# Altium schematic sheet 04 PCIe.SchDoc
size A3; SheetNumber: 5; SheetTotal: 16
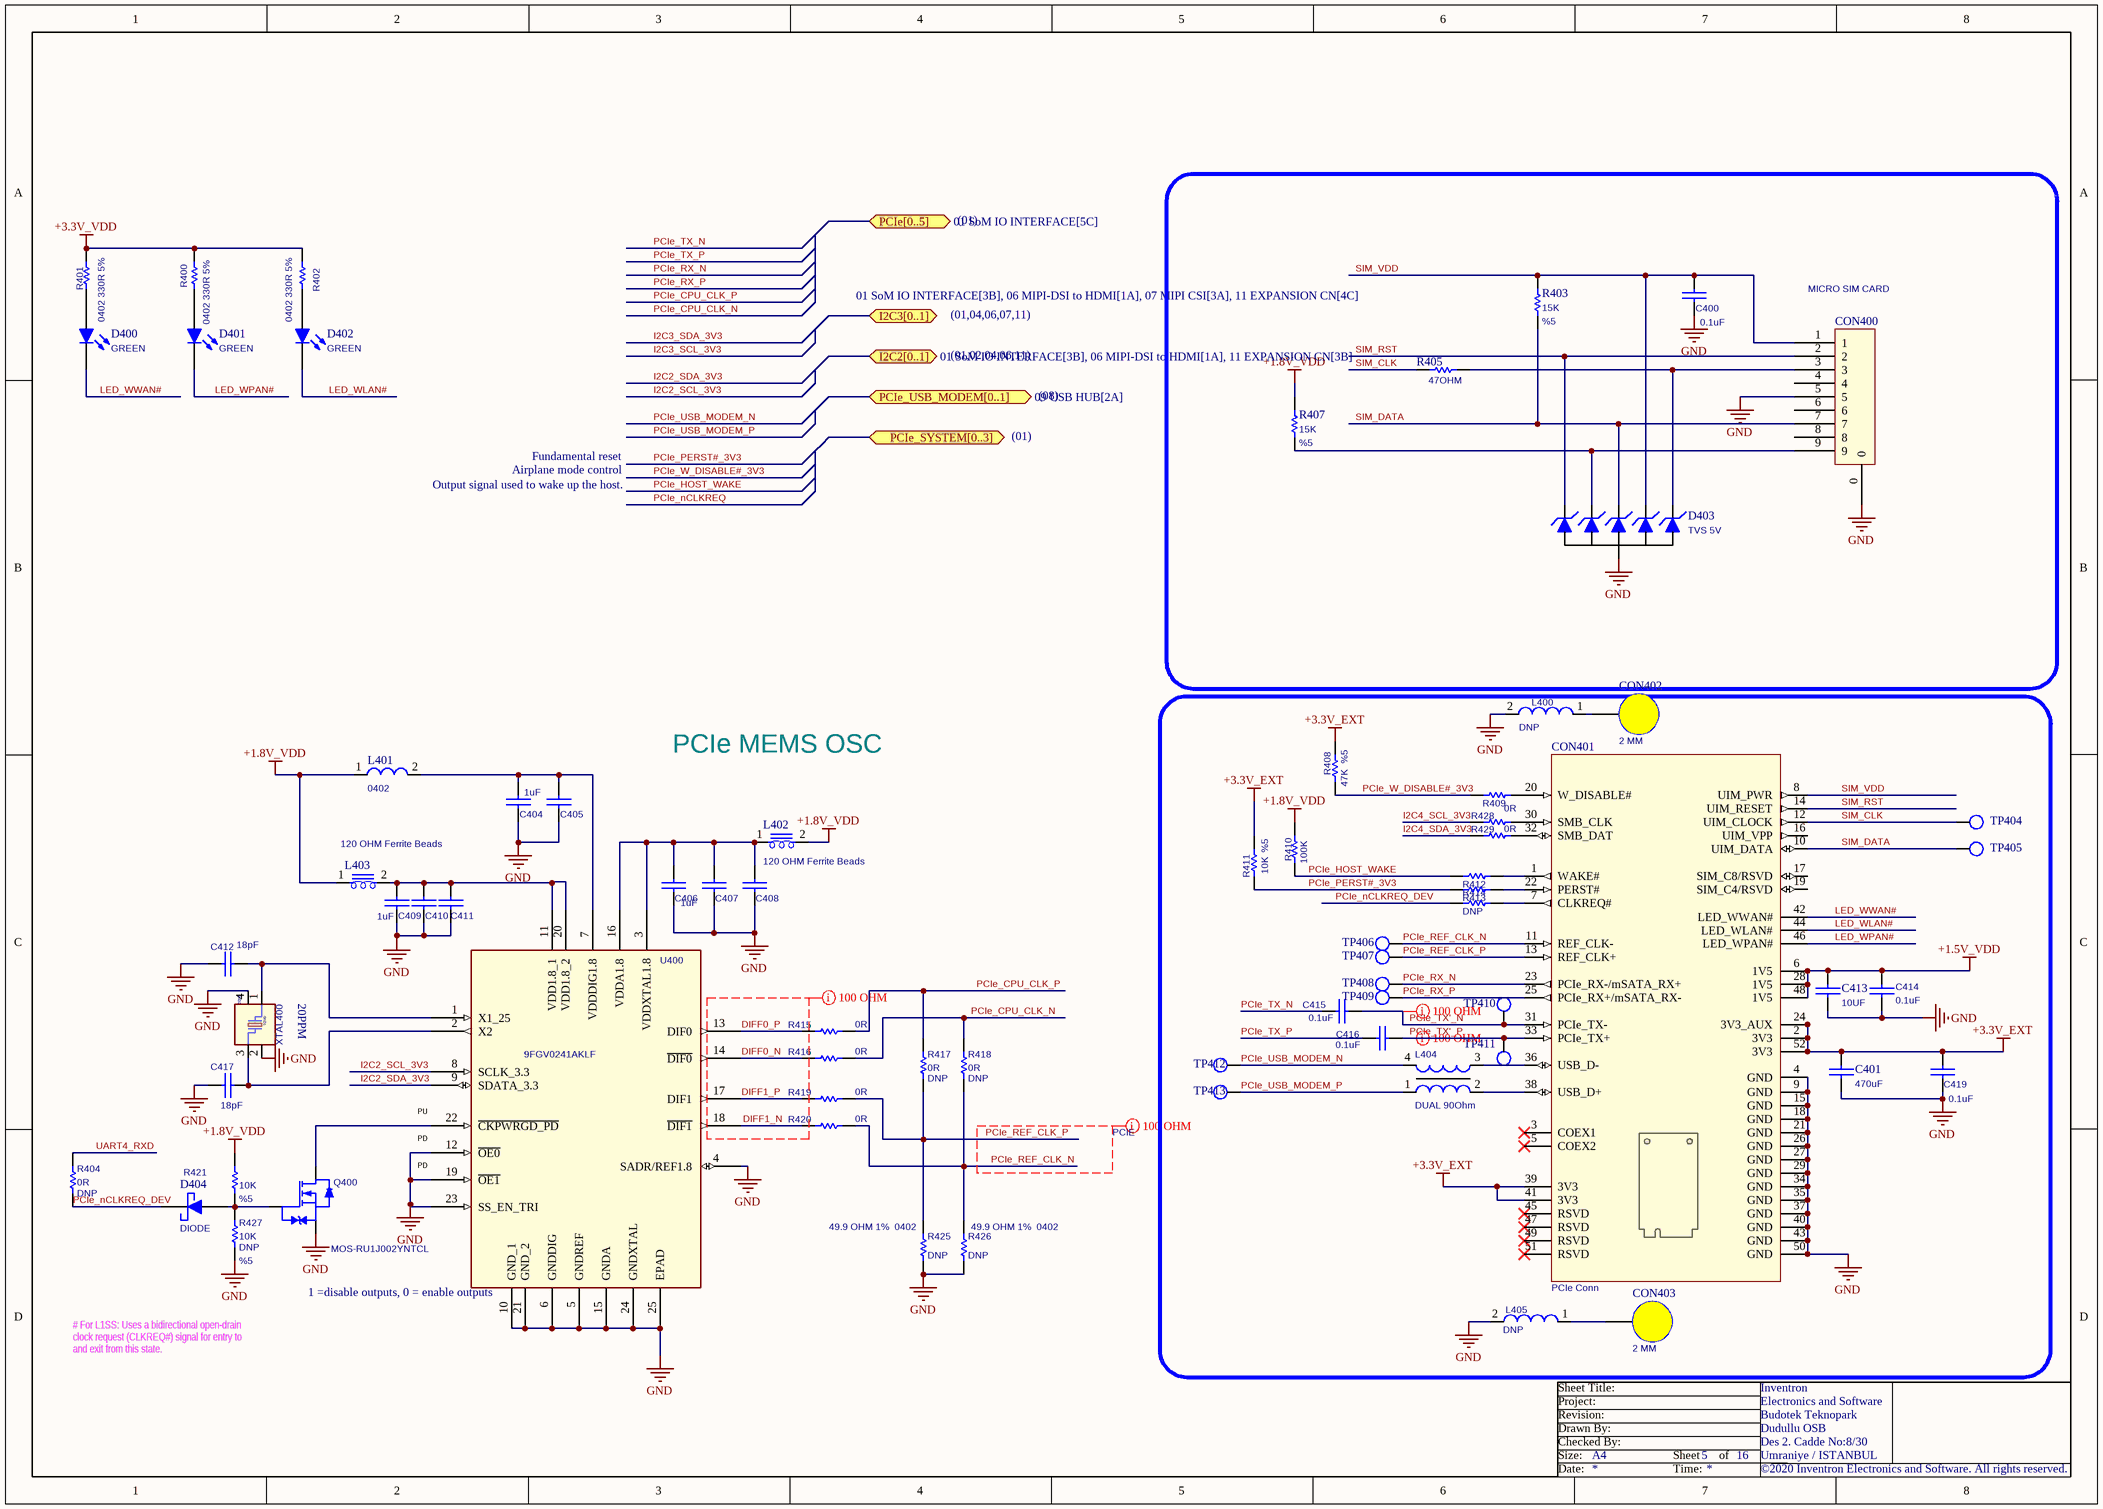
[diagram p0: 04 PCIe.SchDoc]

## Parts
C400  0.1uF  [0402_CC]
C401  470uF  [CAP-8.3mm x 8.3mm]
C404  1uF  [0402_CC]
C405  0.01uF 16V 0402  [0402_CC]  (value not drawn)
C406  1uF  [0402_CC]
C407  0.01uF 16V 0402  [0402_CC]  (value not drawn)
C408  0.01uF 16V 0402  [0402_CC]  (value not drawn)
C409  1uF  [0402_CC]
C410  0.01uF 16V 0402  [0402_CC]  (value not drawn)
C411  0.01uF 16V 0402  [0402_CC]  (value not drawn)
C412  18pF  [0402_CC]
C413  10UF  [0805]
C414  0.1uF  [0402_CC]
C415  0.1uF  [0402_CC]
C416  0.1uF  [0402_CC]
C417  18pF  [0402_CC]
C419  0.1uF  [0402_CC]
CON400  MICRO SIM CARD  [115Q-BCA0]
CON401  PCIe Conn  [PCIe MINI 52POS (2SCREW)]
CON402  2 MM  [9774045243R]
CON403  2 MM  [9774045243R]
D400  GREEN  [0603_LED]
D401  GREEN  [0603_LED]
D402  GREEN  [0603_LED]
D403  TVS 5V  [SC-70]
D404  DIODE  [SOD-323]
L400  ASSY_OPT: DNP  [0603_RES]  (hidden comment: FERRITE 0603)
L401  0402  [0402_RES]
L402  120 OHM Ferrite Beads  [0603_RES]
L403  120 OHM Ferrite Beads  [0603_RES]
L404  DUAL 90Ohm  [DLW21H]
L405  ASSY_OPT: DNP  [0603_RES]  (hidden comment: FERRITE 0603)
Q400  MOS-RU1J002YNTCL  [SC-85-3/SOT-323FL]
R400  0402 330R 5%  [0402_RES]
R401  0402 330R 5%  [0402_RES]
R402  0402 330R 5%  [0402_RES]
R403  15K  Tolerance: %5  [0402_RES]
R404  0R  ASSY_OPT: DNP  [0402_RES]  (no BOM)
R405  47OHM  [0402_RES]
R407  15K  Tolerance: %5  [0402_RES]
R408  47K  Tolerance: %5  [0402_RES]
R409  0402 330R 5%  [0402_RES]  (value not drawn)
R410  100K  [0402_RES]
R411  10K  Tolerance: %5  [0402_RES]
R412  0402 330R 5%  [0402_RES]  (value not drawn)
R413  0402 330R 5%  [0402_RES]  (value not drawn)
R414  ASSY_OPT: DNP  [0402_RES]  (hidden comment: 0402 330R 5%)  (no BOM)
R415  0R  [0402_RES]
R416  0R  [0402_RES]
R417  0R  ASSY_OPT: DNP  [0402_RES]  (no BOM)
R418  0R  ASSY_OPT: DNP  [0402_RES]  (no BOM)
R419  0R  [0402_RES]
R420  0R  [0402_RES]
R421  10K  Tolerance: %5  [0402_RES]
R425  49.9 OHM 1%  0402  ASSY_OPT: DNP  [0402_RES]  (no BOM)
R426  49.9 OHM 1%  0402  ASSY_OPT: DNP  [0402_RES]  (no BOM)
R427  10K  ASSY_OPT: DNP  Tolerance: %5  [0402_RES]  (no BOM)
R428  0R  [0402_RES]
R429  0R  [0402_RES]
TP404  TEST POINT 15  [testpoint_15]  (value not drawn)  (no BOM)
TP405  TEST POINT 15  [testpoint_15]  (value not drawn)  (no BOM)
TP406  TEST POINT 15  [testpoint_15]  (value not drawn)  (no BOM)
TP407  TEST POINT 15  [testpoint_15]  (value not drawn)  (no BOM)
TP408  TEST POINT 15  [testpoint_15]  (value not drawn)  (no BOM)
TP409  TEST POINT 15  [testpoint_15]  (value not drawn)  (no BOM)
TP410  TEST POINT 35  [testpoint_15]  (value not drawn)  (no BOM)
TP411  TEST POINT 35  [testpoint_15]  (value not drawn)  (no BOM)
TP412  TEST POINT 15  [testpoint_15]  (value not drawn)  (no BOM)
TP413  TEST POINT 15  [testpoint_15]  (value not drawn)  (no BOM)
U400  9FGV0241AKLF  [9FGV0241AKLF]
XTAL400  XTAL-TSX-3225 25.0000MF10P-C0  [XTLOSC4_3P2X2P5MM_SM]  (value not drawn)

## Ports
I2C2[0..1] (bidir, see 01 SoM IO INTERFACE[3B], 06 MIPI-DSI to HDMI[1A], 11 EXPANSION CN[3B]), I2C3[0..1] (bidir, see 01 SoM IO INTERFACE[3B], 06 MIPI-DSI to HDMI[1A], 07 MIPI CSI[3A], 11 EXPANSION CN[4C]), PCIe[0..5] (bidir, see 01 SoM IO INTERFACE[5C]), PCIe_SYSTEM[0..3] (bidir), PCIe_USB_MODEM[0..1] (bidir, see 09 USB HUB[2A])

## Nets
+1.5V_VDD: C413.1 C414.2 CON401.6(1V5) CON401.28(1V5) CON401.48(1V5)
+1.8V_VDD: L401.1 L402.2 L403.1 R407.2 R410.2 R421.2
+3.3V_EXT: C401.1 C419.1 CON401.2(3V3) CON401.24(3V3_AUX) CON401.39(3V3) CON401.41(3V3) CON401.52(3V3) R408.2 R411.2
+3.3V_VDD: R400.2 R401.2 R402.2
GND: C400.2 C401.2 C404.2 C405.2 C406.2 C407.2 C408.2 C409.2 C410.2 C411.2 C412.1 C413.2 C414.1 C417.1 C419.2 CON400.0 CON400.5 CON401.4(GND) CON401.9(GND) CON401.15(GND) CON401.18(GND) CON401.21(GND) CON401.26(GND) CON401.27(GND) CON401.29(GND) CON401.34(GND) CON401.35(GND) CON401.37(GND) CON401.40(GND) CON401.43(GND) CON401.50(GND) D403.2 L400.2 L405.2 Q400.2(S) R425.1 R426.1 R427.1 U400.4(SADR/REF1.8) U400.5(GNDREF) U400.6(GNDDIG) U400.10(GND_1) U400.12(~{OE0}) U400.15(GNDA) U400.19(~{OE1}) U400.21(GND_2) U400.23(SS_EN_TRI) U400.24(GNDXTAL) U400.25(EPAD) XTAL400.2(GND1) XTAL400.4(GND2)
DIFF0_N: R416.1 U400.14(~{DIF0})
DIFF0_P: R415.1 U400.13(DIF0)
DIFF1_N: R420.1 U400.18(~{DIF1})
DIFF1_P: R419.1 U400.17(DIF1)
I2C2_SCL_3V3: U400.8(SCLK_3.3)
I2C2_SDA_3V3: U400.9(SDATA_3.3)
I2C4_SCL_3V3: R428.1
I2C4_SDA_3V3: R429.1
LED_WLAN#: CON401.44(LED_WLAN#) D402.2(K)
LED_WPAN#: CON401.46(LED_WPAN#) D401.2(K)
LED_WWAN#: CON401.42(LED_WWAN#) D400.2(K)
PCIe_CPU_CLK_N: R416.2 R418.2
PCIe_CPU_CLK_P: R415.2 R417.2
PCIe_HOST_WAKE: R410.1 R412.2
PCIe_nCLKREQ_DEV: D404.K R404.1 R414.2
PCIe_PERST#_3V3: R411.1 R413.2
PCIe_REF_CLK_N: CON401.11(REF_CLK-) R418.1 R420.2 R426.2 TP406.1
PCIe_REF_CLK_P: CON401.13(REF_CLK+) R417.1 R419.2 R425.2 TP407.1
PCIe_RX_N: CON401.23(PCIe_RX-/mSATA_RX+) TP408.1
PCIe_RX_P: CON401.25(PCIe_RX+/mSATA_RX-) TP409.1
PCIe_TX'_N: C415.2 CON401.31(PCIe_TX-) TP410.1
PCIe_TX'_P: C416.2 CON401.33(PCIe_TX+) TP411.1
PCIe_TX_N: C415.1
PCIe_TX_P: C416.1
PCIe_USB_MODEM_N: L404.4 TP412.1
PCIe_USB_MODEM_P: L404.1 TP413.1
PCIe_W_DISABLE#_3V3: R408.1 R409.2
SIM_CLK: CON401.12(UIM_CLOCK) R405.1 TP404.1
SIM_DATA: CON400.7 CON401.10(UIM_DATA) D403.4 R403.1 TP405.1
SIM_RST: CON400.2 CON401.14(UIM_RESET) D403.1
SIM_VDD: C400.1 CON400.1 CON401.8(UIM_PWR) D403.5 R403.2
UART4_RXD: R404.2
NetC404_1: C404.1 C405.1 L401.2 U400.7(VDDDIG1.8)
NetC406_1: C406.1 C407.1 C408.1 L402.1 U400.3(VDDXTAL1.8) U400.16(VDDA1.8)
NetC409_1: C409.1 C410.1 C411.1 L403.2 U400.11(VDD1.8_1) U400.20(VDD1.8_2)
NetC412_2: C412.2 U400.1(X1_25) XTAL400.1
NetC417_2: C417.2 U400.2(X2) XTAL400.3
NetCON400_3: CON400.3 D403.6 R405.2
NetCON400_9: CON400.9 D403.3 R407.1
NetCON401_1: CON401.1(WAKE#) R412.1
NetCON401_7: CON401.7(CLKREQ#) R414.1
NetCON401_20: CON401.20(W_DISABLE#) R409.1
NetCON401_22: CON401.22(PERST#) R413.1
NetCON401_30: CON401.30(SMB_CLK) R428.2
NetCON401_32: CON401.32(SMB_DAT) R429.2
NetCON401_36: CON401.36(USB_D-) L404.3
NetCON401_38: CON401.38(USB_D+) L404.2
NetCON402_1: CON402.1 L400.1
NetCON403_1: CON403.1 L405.1
NetD400_1: D400.1(A) R401.1
NetD401_1: D401.1(A) R400.1
NetD402_1: D402.1(A) R402.1
NetD404_A: D404.A Q400.1(G) R421.1 R427.2
NetQ400_3: Q400.3(D) U400.22(~{CKPWRGD_PD})

Not connected (* = marked no-connect by the designer): CON400 4 6 8; CON401 3(COEX1)* 5(COEX2)* 16(UIM_VPP) 17(SIM_C8/RSVD) 19(SIM_C4/RSVD) 45(RSVD)* 47(RSVD)* 49(RSVD)* 51(RSVD)*

## Layout directives
differential pair; differential pair class DIFF PCIe 85 OHM: DIFF0_N, DIFF0_P, DIFF1_N, DIFF1_P, PCIe_TX'_N, PCIe_TX'_P
differential pair; differential pair class DIFF PCIe 85 OHM; net class PCIE: PCIe_REF_CLK_N, PCIe_REF_CLK_P

## Notes on the sheet
- (01)
- (01,04,06,07,11)
- (01,02,04,06,11)
- (08)
- Output signal used to wake up the host.
- Airplane mode control
- Fundamental reset
- PCIe MEMS OSC
- (near XTAL400) 20PPM
- (near U400) PU
- (near U400) PD
- (near U400) 1 =disable outputs, 0 = enable outputs
- # For L1SS: Uses a bidirectional open-drain
  clock request (CLKREQ#) signal for entry to
  and exit from this state.
- Sheet Title:
- Inventron
- Size:
- Drawn By:
- Revision:
- Project:
- Checked By:
- A4
- Sheet
- of
- Budotek Teknopark
- Dudullu OSB
- Des 2. Cadde No:8/30
- Umraniye / ISTANBUL
- Electronics and Software
- Date:
- Time:
- ©2020 Inventron Electronics and Software. All rights reserved.

## Library data of the parts
C400 C414-C416 C419 = CAP-CL05B104KO5NNNC: CAP VER 0.1UF 16V X7R 0402; Manufacturer-1: SAMSUNG; Opt. Temp.: -55/+125; Class: Capacitor; Manufacturer Part Number-1: CL05B104KO5NNNC; Footprint: 0402; Manufacturer-2: *; Manufacturer Part Number-2: *; Inventron Stock No: *; Created By: LA; Created Date: 23.11.2018; Checked By: *; ASSY_OPT: *; Dimensions: *; Unit Price: 0,00499; Revision Date/Note: *; Price Break: 10K
C401 = CAP-EEE-FP0J471AP: CAP ALUM 470UF 20% 6.3V SMD; Manufacturer-1: Panasonic Electronic Components; Class: Capacitor; Manufacturer Part Number-1: EEE-FP0J471AP; Footprint: (8.30mm x 8.30mm); Manufacturer-2: *; Manufacturer Part Number-2: *; Inventron Stock No: *; Created By: EE; Created Date: *; Checked By: *; ASSY_OPT: *; Dimensions: *; Unit Price: 0.294; Revision Date/Note: *; Price Break: 1000; Opt. Temp.: *; Features: *
C404 C406 C409 = CAP-CL05X105KQ5NNNC: CAP CER 1UF 6.3V X6S 0402; Manufacturer-1: SAMSUNG; Opt. Temp.: -55/+125; Class: Capacitor; Manufacturer Part Number-1: CL05X105KQ5NNNC; Footprint: 0402; Manufacturer-2: *; Manufacturer Part Number-2: *; Inventron Stock No: *; Created By: LA; Created Date: 23.11.2018; Checked By: *; ASSY_OPT: *; Dimensions: *; Unit Price: 0,00860; Revision Date/Note: *; Price Break: 10K
C405 C407 C408 C410 C411 = CAP-CL05B103KO5NNNC: CAP CER 10000PF 16V X7R 0402; Manufacturer-1: Samsung Electro-Mechanics; Opt. Temp.: -55°C ~ 125°C; Class: Capacitor; Manufacturer Part Number-1: CL05B103KO5NNNC; Footprint: 0402; Manufacturer-2: *; Manufacturer Part Number-2: *; Inventron Stock No: *; Created By: E.E; Created Date: *; Checked By: *; ASSY_OPT: *; Dimensions: *; Unit Price: *; Revision Date/Note: *; Price Break: *; Features: *
C412 C417 = CAP-CC0402JRNPO9BN180: CAP CER 18PF 50V C0G/NPO 0402; Manufacturer-1: YAGEO; Opt. Temp.: -55/+125; Class: Capacitor; Manufacturer Part Number-1: CC0402JRNPO9BN180; Footprint: 0402; Manufacturer-2: *; Manufacturer Part Number-2: *; Inventron Stock No: *; Created By: LA; Created Date: 23.11.2018; Checked By: *; ASSY_OPT: *; Dimensions: *; Unit Price: 0,00590; Revision Date/Note: *; Price Break: 10K
C413 = CAP-CL21A106KOQNNNG: CAP CER 10UF 16V X5R 0805; Manufacturer-1: SAMSUNG; Class: Capacitor; Manufacturer Part Number-1: CL21A106KOQNNNG; Footprint: *; Manufacturer-2: *; Manufacturer Part Number-2: *; Inventron Stock No: *; Created By: EE; Created Date: *; Checked By: *; ASSY_OPT: *; Dimensions: *; Unit Price: 0.01876; Revision Date/Note: *; Price Break: 3000; Opt. Temp.: *; Features: *
CON400 = CON-115Q-BCA0: CONN.MICRO SIM CARD PUSH PUSH 8+2 SMT WITH SWITCH; Manufacturer-1: ATTEND; Class: Connector; Manufacturer Part Number-1: 115Q-BCA0; Footprint: *; Manufacturer-2: *; Manufacturer Part Number-2: *; Inventron Stock No: *; Created By: EE; Created Date: *; Checked By: *; ASSY_OPT: *; Dimensions: *; Unit Price: 0.93660; Revision Date/Note: *; Price Break: 800; Opt. Temp.: *; Features: *
CON401 = CON-2041262-1: CONN PCI EXP MINI FEMALE 52POS; Manufacturer-1: TE; Class: Connector; Manufacturer Part Number-1: 2041262-1; Footprint: *; Manufacturer-2: *; Manufacturer Part Number-2: *; Inventron Stock No: *; Created By: E.E; Created Date: *; Checked By: *; ASSY_OPT: *; Dimensions: *; Unit Price: 0.53856; Revision Date/Note: *; Price Break: 1350; Opt. Temp.: *; Features: *
CON402 CON403 = CON-9774045243R: Round Standoff Threaded M2x0.4 Steel 0.177" (4.50mm); Manufacturer-1: Würth Elektronik; Class: Connector; Manufacturer Part Number-1: 9774045243R; Footprint: *; Manufacturer-2: *; Manufacturer Part Number-2: *; Inventron Stock No: *; Created By: EE; Created Date: *; Checked By: *; ASSY_OPT: *; Dimensions: *; Unit Price: 0.739; Revision Date/Note: *; Price Break: 100; Opt. Temp.: *; Features: *
D400-D402 = LED-LTST-C190KRKT: LED SMD 0603 SUPER GREEN; Manufacturer-1: LITEON; Manufacturer Part Number-1: LTST-C190KRKT; Footprint: *; Manufacturer-2: *; Manufacturer Part Number-2: *; Inventron Stock No: *; Created By: *; Created Date: *; Checked By: *; ASSY_OPT: *; Dimensions: *; Unit Price: 0.03343; Revision Date/Note: *; Price Break: 4000; Opt. Temp.: *; Class: Led; Features: *
D403 = DIODE-SMF05C.TCT: TVS DIODE 5V 12.5V SC70-6; Manufacturer-1: TOSHIBA; Manufacturer Part Number-1: SMF05C.TCT; Footprint: SC70-6; Manufacturer-2: *; Manufacturer Part Number-2: *; Inventron Stock No: *; Created By: EE; Created Date: *; Checked By: *; ASSY_OPT: *; Dimensions: *; Unit Price: 0.315D; Revision Date/Note: *; Price Break: 3000; Opt. Temp.: *; Class: Diode
D404 = DIODE-NSR0320MW2T1G: Diode Schottky 1A (DC) Surface Mount SOD-323; Manufacturer-1: ON Semiconductor; Opt. Temp.: -55°C ~ 125°C; Manufacturer Part Number-1: NSR0320MW2T1G; Manufacturer-2: *; Manufacturer Part Number-2: *; Inventron Stock No: *; Created By: E.E; Created Date: 21.10.2020; Checked By: *; ASSY_OPT: *; Dimensions: *; Revision Date/Note: *; Class: Diode
L400 L405 = IND-FERRITE 0603: FERRITE BEAD 0603; Manufacturer Part Number-1: MPZ1608S260ATAH0; Manufacturer-1: TDK; Class: Inductor; Manufacturer-2: *; Inventron Stock No: *; Checked By: *; Dimensions: *; Revision Date/Note: *
L401 = IND-FERRITE (RES 0 OHM) 0402: 0OHM 0402; Manufacturer Part Number-1: RMCF0402ZT0R00; Manufacturer-1: Stackpole Electronics Inc; Class: Inductor; Footprint: 0402; Manufacturer-2: *; Inventron Stock No: *; Created By: EE; Checked By: *; ASSY_OPT: *; Dimensions: *; Unit Price: 0.00186; Revision Date/Note: *; Price Break: 1000
L402 L403 = IND-BLM18PG121SH1D: Ferrite Beads Multi-Layer 120Ohm 25% 100MHz 2A 0.05Ohm DCR 0603 Automotive T/R; Manufacturer-1: Murata Manufacturing; Class: Inductor; Manufacturer Part Number-1: BLM18PG121SH1D; Footprint: 0603; Manufacturer-2: *; Manufacturer Part Number-2: *; Inventron Stock No: *; Created By: E.E; Created Date: 2.11.2020; Checked By: *; ASSY_OPT: *; Dimensions: *; Unit Price: 0.02550; Revision Date/Note: *; Price Break: 4000; Opt. Temp.: *; Features: *
L404 = IND-DLW21HN900SQ2L: Common Mode Chokes Dual 90Ohm 100MHz 0.33A 0.35Ohm DCR SMD T/R; Manufacturer-1: Murata Manufacturing; Class: Inductor; Manufacturer Part Number-1: DLW21HN900SQ2L; Footprint: *; Manufacturer-2: *; Manufacturer Part Number-2: *; Inventron Stock No: *; Created By: E.E; Created Date: 2.11.2020; Checked By: *; ASSY_OPT: *; Dimensions: *; Unit Price: 0.185; Revision Date/Note: *; Price Break: 3000; Opt. Temp.: *; Features: *
Q400 = MOS-RU1J002YNTCL: MOSFET N-CH 50V 0.2A UMT3F; Manufacturer-1: ROHM; Opt. Temp.: -55/+150; Class: Transistor; Manufacturer Part Number-1: RU1J002YNTCL; Footprint: SC-85; Manufacturer-2: *; Manufacturer Part Number-2: *; Inventron Stock No: *; Created By: LA; Created Date: 23.11.2018; Checked By: *; ASSY_OPT: *; Dimensions: *; Unit Price: 0,0384; Revision Date/Note: *; Price Break: 3K
R400-R402 R409 R412-R414 = RES-CRGCQ0402J330R: 330 ±5% 0.063W, 1/16W Chip Resistor 0402 (1005 Metric) Automotive AEC-Q200, Moisture Resistant Thick Film; Manufacturer-1: TE Connectivity Passive Product; Opt. Temp.: -55°C ~ 155°C; Tolerance: %5; Manufacturer Part Number-1: CRGCQ0402J330R; Footprint: 0402; Manufacturer-2: *; Manufacturer Part Number-2: *; Inventron Stock No: *; Created By: E.E; Created Date: 23.10.2020; Checked By: *; Dimensions: *; Unit Price: *; Revision Date/Note: *; Price Break: *; Class: Resistor
  R400-R402 R409 R412 R413: ASSY_OPT: *
R403 R407 = RES-RMCF0402JT15K0: RES 15K OHM 5% 1/16W 0402; Manufacturer-1: STACKPOLE; Opt. Temp.: -55/+155; Class: Resistor; Manufacturer Part Number-1: RMCF0402JT15K0; Footprint: 0402; Manufacturer-2: *; Manufacturer Part Number-2: *; Inventron Stock No: *; Created By: LA; Created Date: 23.11.2018; Checked By: *; ASSY_OPT: *; Dimensions: *; Unit Price: 0,00127; Revision Date/Note: *; Price Break: 10K
R404 R415-R420 R428 R429 = RES-RMCF0402ZT0R00: RES 0 OHM JUMPER 1/16W 0402; Manufacturer-1: STACKPOLE; Opt. Temp.: -55/+155; Class: Resistor; Manufacturer Part Number-1: RMCF0402ZT0R00; Footprint: 0402; Manufacturer-2: *; Manufacturer Part Number-2: *; Inventron Stock No: *; Created By: LA; Created Date: 23.11.2018; Checked By: *; Dimensions: *; Unit Price: 0,00127; Revision Date/Note: *; Price Break: 10K
  R415 R416 R419 R420 R428 R429: ASSY_OPT: *
R405 = RES-RC0402JR-0747RL: RES SMD 47 OHM 5% 1/16W 0402; Manufacturer-1: Yageo; Class: Resistor; Manufacturer Part Number-1: RC0402JR-0747RL; Footprint: 0402; Manufacturer-2: *; Manufacturer Part Number-2: *; Inventron Stock No: *; Created By: EE; Created Date: *; Checked By: *; ASSY_OPT: *; Dimensions: *; Unit Price: *; Revision Date/Note: *; Price Break: *; Opt. Temp.: *; Tolerance: *
R408 = RES-47K: RES 47K OHM 5% 1/16W 0402; Opt. Temp.: -55/+155; Class: Resistor; Footprint: 0402; Manufacturer-2: *; Manufacturer Part Number-2: *; Inventron Stock No: *; Created By: LA; Checked By: *; ASSY_OPT: *; Dimensions: *; Revision Date/Note: *
R410 = RES-RMCF0402JT100K: RES 100K OHM 5% 1/16W 0402; Manufacturer-1: STACKPOLE; Opt. Temp.: -55/+155; Class: Resistor; Tolerance: %5; Manufacturer Part Number-1: RMCF0402JT100K; Footprint: 0402; Manufacturer-2: *; Manufacturer Part Number-2: *; Inventron Stock No: *; Created By: LA; Created Date: 23.11.2018; Checked By: *; ASSY_OPT: *; Dimensions: *; Unit Price: 0,00127; Revision Date/Note: *; Price Break: 10K; Features: AUTOMOTIVE
R411 R421 R427 = RES-RMCF0402JT10K0: RES 10K OHM 5% 1/16W 0402; Manufacturer-1: STACKPOLE; Opt. Temp.: -55/+155; Class: Resistor; Manufacturer Part Number-1: RMCF0402JT10K0; Footprint: 0402; Manufacturer-2: *; Manufacturer Part Number-2: *; Inventron Stock No: *; Created By: LA; Created Date: 23.11.2018; Checked By: *; Dimensions: *; Unit Price: 0,00127; Revision Date/Note: *; Price Break: 10K
  R411 R421: ASSY_OPT: *
R425 R426 = RES-CR0402-FX-49R9GLF: 49.9 ±1% 0.063W, 1/16W Chip Resistor 0402 (1005 Metric) - Thick Film; Manufacturer-1: Bourns Inc.; Opt. Temp.: -55°C ~ 155°C; Manufacturer Part Number-1: CR0402-FX-49R9GLF; Footprint: 0402; Manufacturer-2: *; Manufacturer Part Number-2: *; Inventron Stock No: *; Created By: E.E; Created Date: 21.10.2020; Checked By: *; Dimensions: *; Unit Price: *; Revision Date/Note: *; Price Break: *; Class: Resistor; Tolerance: ±1%
U400 = IC-9FGV0241AKLF: IC CLOCK GENERATOR 24VFQFPN; Manufacturer-1: Renesas Electronics America Inc.; Opt. Temp.: 0 to 70; Class: ICs; Manufacturer Part Number-1: 9FGV0241AKLF; Footprint: *; Manufacturer-2: *; Manufacturer Part Number-2: *; Inventron Stock No: *; Created By: E.E; Created Date: 13.10.20; Checked By: *; ASSY_OPT: *; Dimensions: *; Unit Price: *; Revision Date/Note: *; Price Break: *
XTAL400 = XTAL-TSX-3225 25.0000MF10P-C0: CRYSTAL 25.0000MHZ 18PF SMD; Manufacturer-1: EPSON; Opt. Temp.: +40/+85; Manufacturer Part Number-1: TSX-3225 25.0000MF10P-C0; Footprint: 4-SMD; Manufacturer-2: *; Manufacturer Part Number-2: *; Inventron Stock No: *; Created By: E.E; Created Date: 20.10.2020; Checked By: *; ASSY_OPT: *; Dimensions: *; Unit Price: 0,176; Revision Date/Note: *; Price Break: 2K; Class: Crystal